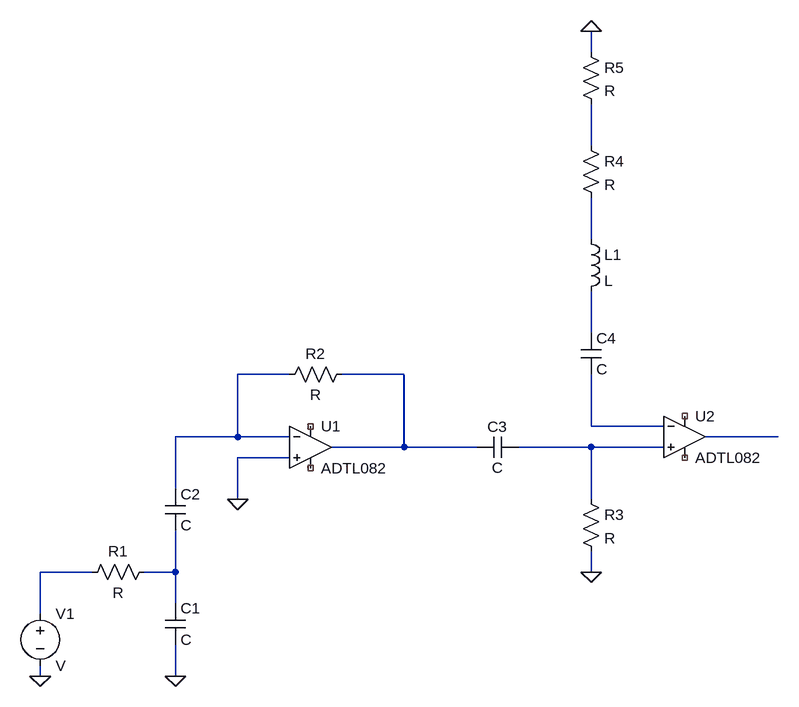
[diagram p0: schematic catenelle.asc]
catenelle.asc, the LTspice schematic file:
Version 4.1
SHEET 1 1012 680
WIRE 720 -704 720 -736
WIRE 720 -560 720 -624
WIRE 720 -416 720 -480
WIRE 720 -272 720 -336
WIRE 256 -208 176 -208
WIRE 432 -208 336 -208
WIRE 720 -128 720 -208
WIRE 832 -128 720 -128
WIRE 176 -112 176 -208
WIRE 176 -112 80 -112
WIRE 256 -112 176 -112
WIRE 1008 -112 896 -112
WIRE 432 -96 432 -208
WIRE 432 -96 320 -96
WIRE 544 -96 432 -96
WIRE 720 -96 608 -96
WIRE 832 -96 720 -96
WIRE 256 -80 176 -80
WIRE 80 -32 80 -112
WIRE 176 -16 176 -80
WIRE 720 -16 720 -96
WIRE -48 96 -128 96
WIRE 80 96 80 32
WIRE 80 96 32 96
WIRE 720 96 720 64
WIRE 80 144 80 96
WIRE -128 160 -128 96
WIRE -128 256 -128 240
WIRE 80 256 80 208
FLAG 80 256 0
FLAG 176 -16 0
FLAG -128 256 0
FLAG 720 96 0
FLAG 720 -736 0
SYMBOL cap 64 -32 R0
SYMATTR InstName C2
SYMBOL res 352 -224 R90
WINDOW 0 0 56 VBottom 2
WINDOW 3 32 56 VTop 2
SYMATTR InstName R2
SYMBOL OpAmps\\ADTL082 288 -160 R0
SYMATTR InstName U1
SYMBOL cap 64 144 R0
SYMATTR InstName C1
SYMBOL res 48 80 R90
WINDOW 0 0 56 VBottom 2
WINDOW 3 32 56 VTop 2
SYMATTR InstName R1
SYMBOL voltage -128 144 R0
SYMATTR InstName V1
SYMBOL cap 608 -112 R90
WINDOW 0 0 32 VBottom 2
WINDOW 3 32 32 VTop 2
SYMATTR InstName C3
SYMBOL res 704 -32 R0
SYMATTR InstName R3
SYMBOL OpAmps\\ADTL082 864 -176 R0
SYMATTR InstName U2
SYMBOL cap 704 -272 R0
SYMATTR InstName C4
SYMBOL ind 704 -432 R0
SYMATTR InstName L1
SYMBOL res 704 -576 R0
SYMATTR InstName R4
SYMBOL res 704 -720 R0
SYMATTR InstName R5

The netlist it stands for:
* catenelle.asc
C2 N004 N010 C
R2 N005 N004 R
X§U1 0 N004 NC_01 NC_02 N005 ADTL082  ; pins In+ In- V+ V- OUT
C1 N010 0 C
R1 N010 N009 R
V1 N009 0 V
C3 N008 N005 C
R3 N008 0 R
X§U2 N008 N006 NC_03 NC_04 N007 ADTL082  ; pins In+ In- V+ V- OUT
C4 N003 N006 C
L1 N002 N003 L
R4 N001 N002 R
R5 0 N001 R
.lib ADI.lib
.backanno
.end